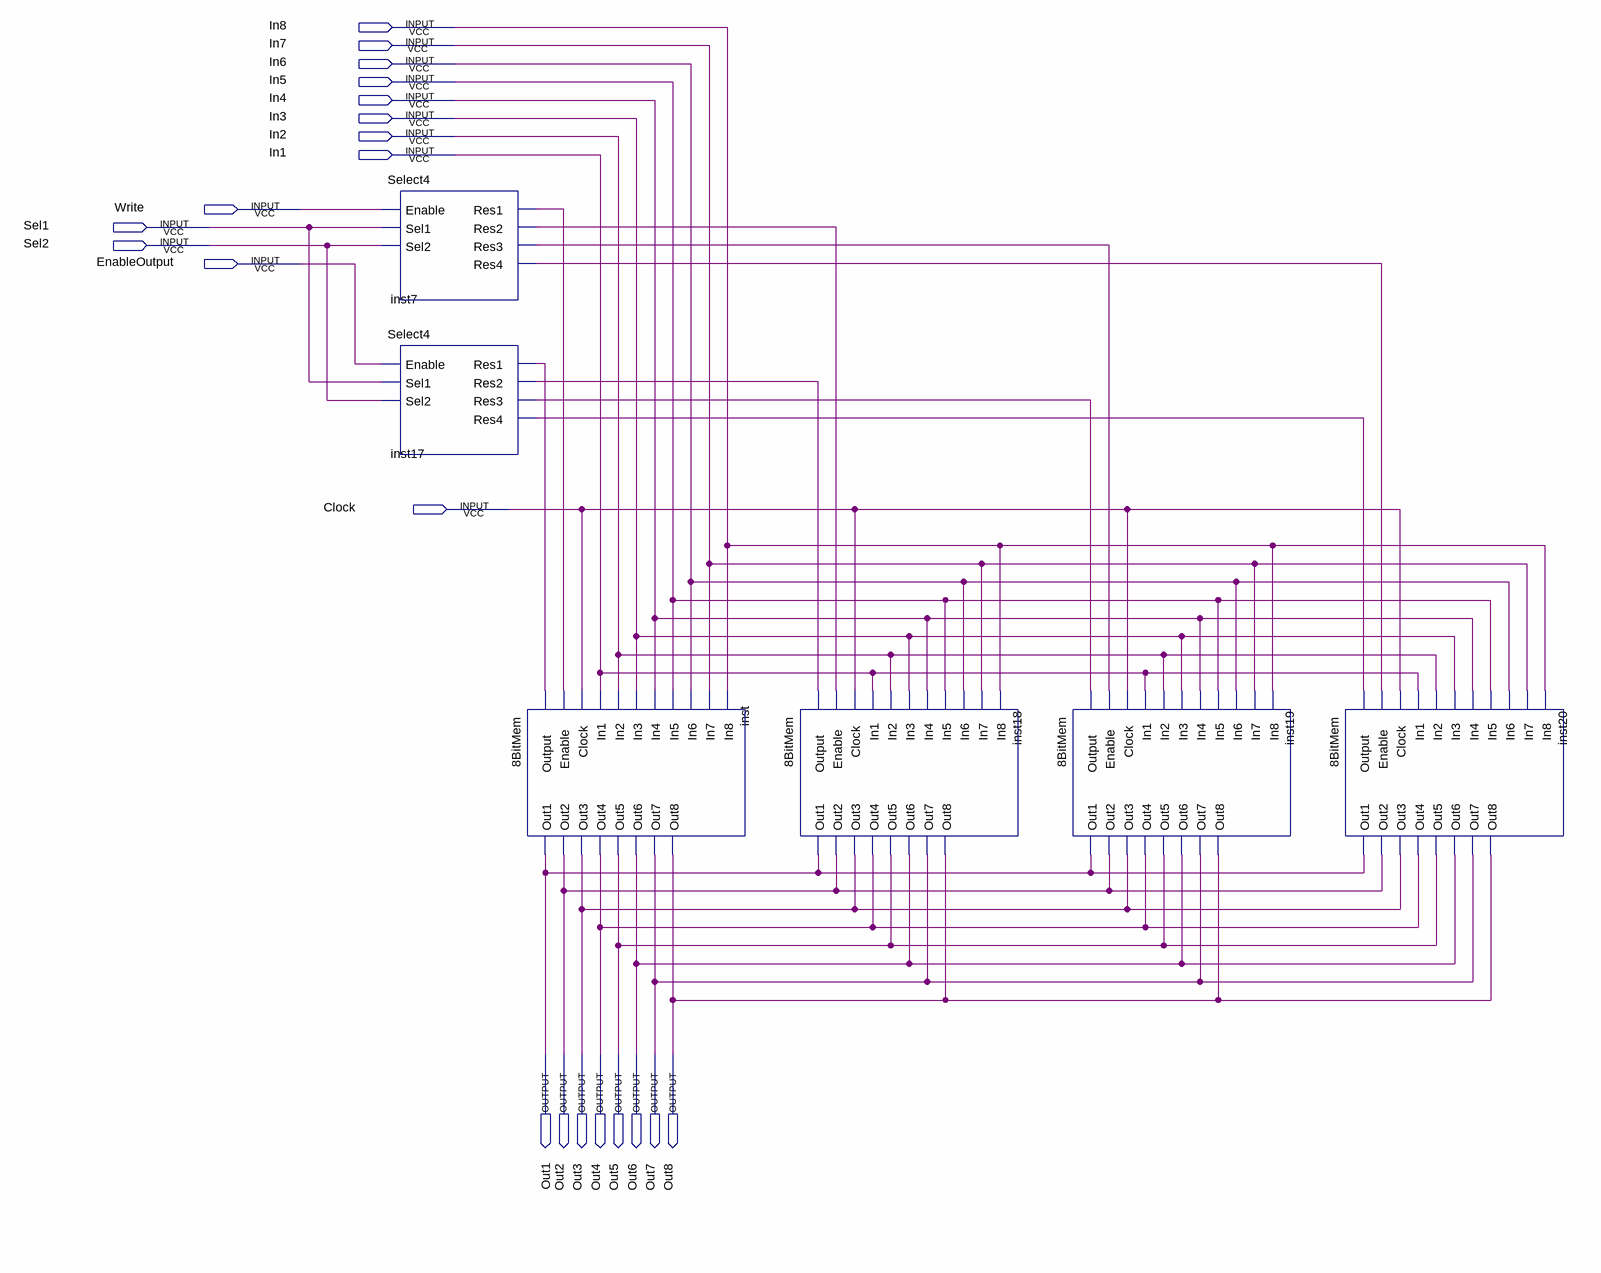
[diagram p0: schematic sheet]
// Quartus schematic TRX_RAM_4Byte.bdf as structural Verilog: 6 symbols, 21 pins
module TRX_RAM_4Byte (
  input  In8,
  input  In7,
  input  In6,
  input  In5,
  input  In4,
  input  In3,
  input  In2,
  input  In1,
  input  Write,
  input  Sel1,
  input  Sel2,
  input  EnableOutput,
  input  Clock,
  output Out1,
  output Out2,
  output Out3,
  output Out4,
  output Out5,
  output Out6,
  output Out7,
  output Out8
);

  wire inst7_res1, inst7_res2, inst7_res3, inst7_res4, inst17_res1, inst17_res2, inst17_res3, inst17_res4;

  Select4 inst7 (
    .Enable(Write), .Sel1(Sel1), .Sel2(Sel2), .Res1(inst7_res1), .Res2(inst7_res2), .Res3(inst7_res3),
    .Res4(inst7_res4));
  Select4 inst17 (
    .Enable(EnableOutput), .Sel1(Sel1), .Sel2(Sel2), .Res1(inst17_res1), .Res2(inst17_res2),
    .Res3(inst17_res3), .Res4(inst17_res4));
  \8BitMem  inst (
    .Output(inst17_res1), .Enable(inst7_res1), .Clock(Clock), .In1(In1), .In2(In2), .In3(In3), .In4(In4),
    .In5(In5), .In6(In6), .In7(In7), .In8(In8), .Out1(Out1), .Out2(Out2), .Out3(Out3), .Out4(Out4),
    .Out5(Out5), .Out6(Out6), .Out7(Out7), .Out8(Out8));
  \8BitMem  inst18 (
    .Output(inst17_res2), .Enable(inst7_res2), .Clock(Clock), .In1(In1), .In2(In2), .In3(In3), .In4(In4),
    .In5(In5), .In6(In6), .In7(In7), .In8(In8), .Out1(Out1), .Out2(Out2), .Out3(Out3), .Out4(Out4),
    .Out5(Out5), .Out6(Out6), .Out7(Out7), .Out8(Out8));
  \8BitMem  inst19 (
    .Output(inst17_res3), .Enable(inst7_res3), .Clock(Clock), .In1(In1), .In2(In2), .In3(In3), .In4(In4),
    .In5(In5), .In6(In6), .In7(In7), .In8(In8), .Out1(Out1), .Out2(Out2), .Out3(Out3), .Out4(Out4),
    .Out5(Out5), .Out6(Out6), .Out7(Out7), .Out8(Out8));
  \8BitMem  inst20 (
    .Output(inst17_res4), .Enable(inst7_res4), .Clock(Clock), .In1(In1), .In2(In2), .In3(In3), .In4(In4),
    .In5(In5), .In6(In6), .In7(In7), .In8(In8), .Out1(Out1), .Out2(Out2), .Out3(Out3), .Out4(Out4),
    .Out5(Out5), .Out6(Out6), .Out7(Out7), .Out8(Out8));
endmodule
